# Altium schematic sheet FPGA_mgt.SchDoc
size 420 x 297 mm
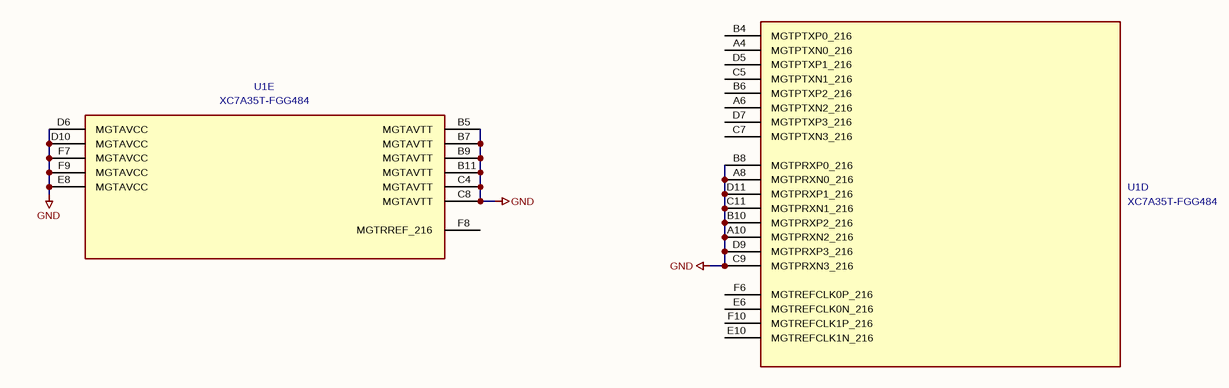
[diagram p0: FPGA_mgt.SchDoc]

## Parts
U1  XC7A35T-FGG484  [FB-BGA-484_23.0x23.0mm_Layout22x22_P1.0mm]  (parts D,E of 7)

## Nets
GND: U1.A8(MGTPRXN0_216) U1.A10(MGTPRXN2_216) U1.B5(MGTAVTT) U1.B7(MGTAVTT) U1.B8(MGTPRXP0_216) U1.B9(MGTAVTT) U1.B10(MGTPRXP2_216) U1.B11(MGTAVTT) U1.C4(MGTAVTT) U1.C8(MGTAVTT) U1.C9(MGTPRXN3_216) U1.C11(MGTPRXN1_216) U1.D6(MGTAVCC) U1.D9(MGTPRXP3_216) U1.D10(MGTAVCC) U1.D11(MGTPRXP1_216) U1.E8(MGTAVCC) U1.F7(MGTAVCC) U1.F9(MGTAVCC)

Not connected (* = marked no-connect by the designer): U1 A4(MGTPTXN0_216) A6(MGTPTXN2_216) B4(MGTPTXP0_216) B6(MGTPTXP2_216) C5(MGTPTXN1_216) C7(MGTPTXN3_216) D5(MGTPTXP1_216) D7(MGTPTXP3_216) E6(MGTREFCLK0N_216) E10(MGTREFCLK1N_216) F6(MGTREFCLK0P_216) F8(MGTRREF_216) F10(MGTREFCLK1P_216)

## Notes on the sheet
- 1
- 2
- 3
- 4
- 5
- 6
- 7
- 8
- A
- B
- C
- D
- E
- Title:
- File: FPGA_mgt.kicad_sch
- Sheet: /
- F
- KiCad E.D.A.  kicad (5.1.4)-1
- Size: A3
- Date:
- Rev:
- Id: 1/1

## Library data of the parts
U1 = XC7A35T-FGG484: Value: XC7A35T-FGG484; Footprint: Package_BGA:FB-BGA-484_23.0x23.0mm_Layout22x22_P1.0mm